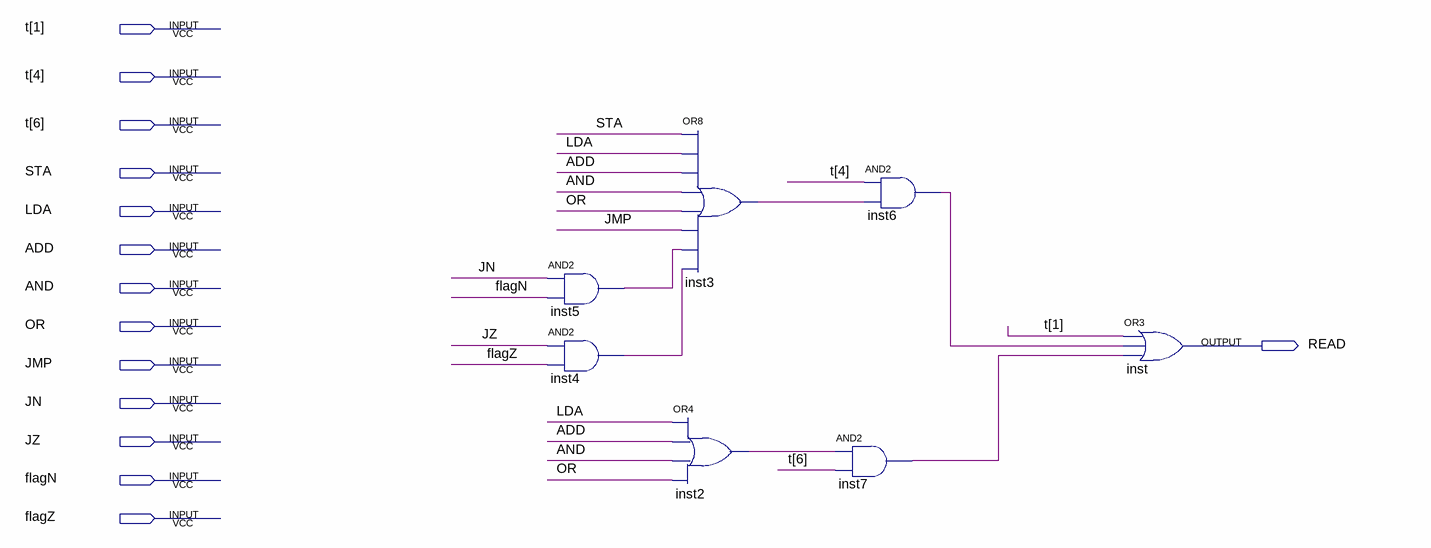
[diagram p0: schematic sheet]
// Quartus schematic READ_LOGIC.bdf as structural Verilog: 7 symbols, 14 pins
module READ_LOGIC (
  input  [6:1] t,
  input  STA,
  input  LDA,
  input  ADD,
  input  AND,
  input  OR,
  input  JMP,
  input  JN,
  input  JZ,
  input  flagN,
  input  flagZ,
  output READ
);

  wire inst2_out, inst3_out, inst4_out, inst5_out, inst6_out, inst7_out;

  and inst5 (inst5_out, JN, flagN);
  and inst4 (inst4_out, JZ, flagZ);
  or inst3 (inst3_out, STA, LDA, ADD, AND, OR, JMP, inst5_out, inst4_out);
  or inst2 (inst2_out, LDA, ADD, AND, OR);
  and inst6 (inst6_out, t[4], inst3_out);
  and inst7 (inst7_out, inst2_out, t[6]);
  or inst (READ, t[1], inst6_out, inst7_out);
endmodule
